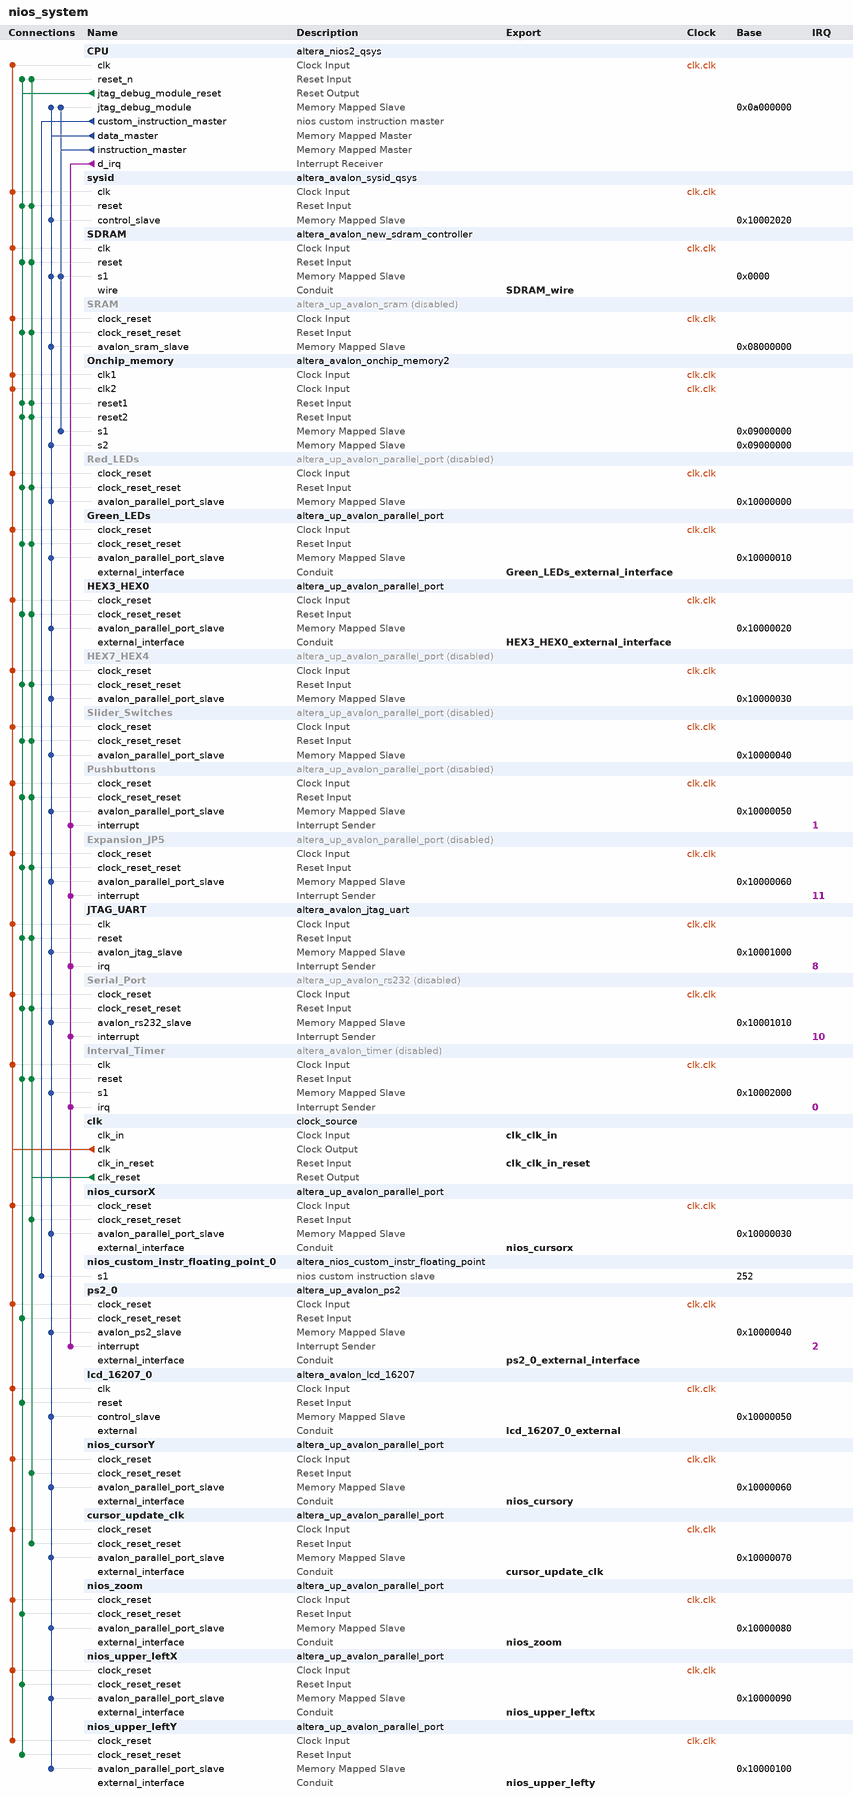
[diagram p0: system contents]
# Platform Designer (Qsys) system nios_system, Cyclone IV E EP4CE115F29C7
# Parameters at their usual value, and those the tool derives, are not listed.
package require -exact qsys 13.0
create_system nios_system
set_project_property DEVICE_FAMILY {Cyclone IV E}
set_project_property DEVICE EP4CE115F29C7

add_instance CPU altera_nios2_qsys 13.0
set_instance_parameter_value CPU muldiv_divider true
set_instance_parameter_value CPU manuallyAssignCpuID false
set_instance_parameter_value CPU resetSlave SDRAM.s1
set_instance_parameter_value CPU exceptionSlave SDRAM.s1
set_instance_parameter_value CPU breakSlave CPU.jtag_debug_module
set_instance_parameter_value CPU mmu_processIDNumBits 10
set_instance_parameter_value CPU impl Tiny
set_instance_parameter_value CPU icache_size 4096
set_instance_parameter_value CPU dcache_lineSize 4

add_instance sysid altera_avalon_sysid_qsys 13.0
set_instance_parameter_value sysid id 0

add_instance SDRAM altera_avalon_new_sdram_controller 13.0.1
set_instance_parameter_value SDRAM TAC 5.5
set_instance_parameter_value SDRAM TRCD 20.0
set_instance_parameter_value SDRAM TRP 20.0
set_instance_parameter_value SDRAM casLatency 3
set_instance_parameter_value SDRAM columnWidth 10
set_instance_parameter_value SDRAM dataWidth 32
set_instance_parameter_value SDRAM generateSimulationModel false
set_instance_parameter_value SDRAM model custom
set_instance_parameter_value SDRAM numberOfBanks 4
set_instance_parameter_value SDRAM numberOfChipSelects 1
set_instance_parameter_value SDRAM powerUpDelay 100.0
set_instance_parameter_value SDRAM refreshPeriod 15.625
set_instance_parameter_value SDRAM rowWidth 13

add_instance SRAM altera_up_avalon_sram 13.0
set_instance_property SRAM ENABLED false
set_instance_parameter_value SRAM board DE2-115
set_instance_parameter_value SRAM pixel_buffer true

add_instance Onchip_memory altera_avalon_onchip_memory2 13.0.1
set_instance_parameter_value Onchip_memory dataWidth 32
set_instance_parameter_value Onchip_memory dualPort true
set_instance_parameter_value Onchip_memory initMemContent true
set_instance_parameter_value Onchip_memory initializationFileName Onchip_memory
set_instance_parameter_value Onchip_memory memorySize 8192

add_instance Red_LEDs altera_up_avalon_parallel_port 13.0
set_instance_property Red_LEDs ENABLED false
set_instance_parameter_value Red_LEDs board DE2-115
set_instance_parameter_value Red_LEDs preset LEDs
set_instance_parameter_value Red_LEDs leds Red
set_instance_parameter_value Red_LEDs capture false
set_instance_parameter_value Red_LEDs edge Rising
set_instance_parameter_value Red_LEDs irq false

add_instance Green_LEDs altera_up_avalon_parallel_port 13.0
set_instance_parameter_value Green_LEDs board DE2-115
set_instance_parameter_value Green_LEDs preset LEDs
set_instance_parameter_value Green_LEDs capture false
set_instance_parameter_value Green_LEDs edge Rising
set_instance_parameter_value Green_LEDs irq false

add_instance HEX3_HEX0 altera_up_avalon_parallel_port 13.0
set_instance_parameter_value HEX3_HEX0 board DE2-115
set_instance_parameter_value HEX3_HEX0 preset {Seven Segment Displays}
set_instance_parameter_value HEX3_HEX0 capture false
set_instance_parameter_value HEX3_HEX0 edge Rising
set_instance_parameter_value HEX3_HEX0 irq false

add_instance HEX7_HEX4 altera_up_avalon_parallel_port 13.0
set_instance_property HEX7_HEX4 ENABLED false
set_instance_parameter_value HEX7_HEX4 board DE2-115
set_instance_parameter_value HEX7_HEX4 preset {Seven Segment Displays}
set_instance_parameter_value HEX7_HEX4 sevensegs {7 to 4}
set_instance_parameter_value HEX7_HEX4 capture false
set_instance_parameter_value HEX7_HEX4 edge Rising
set_instance_parameter_value HEX7_HEX4 irq false

add_instance Slider_Switches altera_up_avalon_parallel_port 13.0
set_instance_property Slider_Switches ENABLED false
set_instance_parameter_value Slider_Switches board DE2-115
set_instance_parameter_value Slider_Switches preset {Slider Switches}
set_instance_parameter_value Slider_Switches capture false
set_instance_parameter_value Slider_Switches edge Rising
set_instance_parameter_value Slider_Switches irq false

add_instance Pushbuttons altera_up_avalon_parallel_port 13.0
set_instance_property Pushbuttons ENABLED false
set_instance_parameter_value Pushbuttons board DE2-115
set_instance_parameter_value Pushbuttons preset Pushbuttons
set_instance_parameter_value Pushbuttons capture true
set_instance_parameter_value Pushbuttons edge Falling
set_instance_parameter_value Pushbuttons irq true

add_instance Expansion_JP5 altera_up_avalon_parallel_port 13.0
set_instance_property Expansion_JP5 ENABLED false
set_instance_parameter_value Expansion_JP5 board DE2-115
set_instance_parameter_value Expansion_JP5 preset {Expansion Header}
set_instance_parameter_value Expansion_JP5 capture true
set_instance_parameter_value Expansion_JP5 edge Falling
set_instance_parameter_value Expansion_JP5 irq true

add_instance JTAG_UART altera_avalon_jtag_uart 13.0.1
set_instance_parameter_value JTAG_UART simInteractiveOptions INTERACTIVE_ASCII_OUTPUT

add_instance Serial_Port altera_up_avalon_rs232 13.0
set_instance_property Serial_Port ENABLED false
set_instance_parameter_value Serial_Port baud 115200
set_instance_parameter_value Serial_Port parity Odd

add_instance Interval_Timer altera_avalon_timer 13.0.1
set_instance_property Interval_Timer ENABLED false
set_instance_parameter_value Interval_Timer period 125.0
set_instance_parameter_value Interval_Timer periodUnits MSEC

add_instance clk clock_source 13.0
set_instance_parameter_value clk clockFrequency 50000000

add_instance nios_cursorX altera_up_avalon_parallel_port 13.0
set_instance_parameter_value nios_cursorX board DE2-115
set_instance_parameter_value nios_cursorX custom_port true
set_instance_parameter_value nios_cursorX preset LEDs
set_instance_parameter_value nios_cursorX capture false
set_instance_parameter_value nios_cursorX edge Rising
set_instance_parameter_value nios_cursorX irq false

add_instance nios_custom_instr_floating_point_0 altera_nios_custom_instr_floating_point 13.0

add_instance ps2_0 altera_up_avalon_ps2 13.0

add_instance lcd_16207_0 altera_avalon_lcd_16207 13.0.1

add_instance nios_cursorY altera_up_avalon_parallel_port 13.0
set_instance_parameter_value nios_cursorY board DE2-115
set_instance_parameter_value nios_cursorY custom_port true
set_instance_parameter_value nios_cursorY preset LEDs
set_instance_parameter_value nios_cursorY capture false
set_instance_parameter_value nios_cursorY edge Rising
set_instance_parameter_value nios_cursorY irq false

add_instance cursor_update_clk altera_up_avalon_parallel_port 13.0
set_instance_parameter_value cursor_update_clk board DE2-115
set_instance_parameter_value cursor_update_clk custom_port true
set_instance_parameter_value cursor_update_clk preset LEDs
set_instance_parameter_value cursor_update_clk capture false
set_instance_parameter_value cursor_update_clk edge Rising
set_instance_parameter_value cursor_update_clk irq false

add_instance nios_zoom altera_up_avalon_parallel_port 13.0
set_instance_parameter_value nios_zoom board DE2-115
set_instance_parameter_value nios_zoom custom_port true
set_instance_parameter_value nios_zoom preset LEDs
set_instance_parameter_value nios_zoom capture false
set_instance_parameter_value nios_zoom edge Rising
set_instance_parameter_value nios_zoom irq false

add_instance nios_upper_leftX altera_up_avalon_parallel_port 13.0
set_instance_parameter_value nios_upper_leftX board DE2-115
set_instance_parameter_value nios_upper_leftX custom_port true
set_instance_parameter_value nios_upper_leftX preset LEDs
set_instance_parameter_value nios_upper_leftX capture false
set_instance_parameter_value nios_upper_leftX edge Rising
set_instance_parameter_value nios_upper_leftX irq false

add_instance nios_upper_leftY altera_up_avalon_parallel_port 13.0
set_instance_parameter_value nios_upper_leftY board DE2-115
set_instance_parameter_value nios_upper_leftY custom_port true
set_instance_parameter_value nios_upper_leftY preset LEDs
set_instance_parameter_value nios_upper_leftY capture false
set_instance_parameter_value nios_upper_leftY edge Rising
set_instance_parameter_value nios_upper_leftY irq false

# connections
add_connection clk.clk CPU.clk clock
add_connection clk.clk cursor_update_clk.clock_reset clock
add_connection clk.clk Expansion_JP5.clock_reset clock
add_connection clk.clk Green_LEDs.clock_reset clock
add_connection clk.clk HEX3_HEX0.clock_reset clock
add_connection clk.clk HEX7_HEX4.clock_reset clock
add_connection clk.clk Interval_Timer.clk clock
add_connection clk.clk JTAG_UART.clk clock
add_connection clk.clk lcd_16207_0.clk clock
add_connection clk.clk nios_cursorX.clock_reset clock
add_connection clk.clk nios_cursorY.clock_reset clock
add_connection clk.clk nios_upper_leftX.clock_reset clock
add_connection clk.clk nios_upper_leftY.clock_reset clock
add_connection clk.clk nios_zoom.clock_reset clock
add_connection clk.clk Onchip_memory.clk1 clock
add_connection clk.clk Onchip_memory.clk2 clock
add_connection clk.clk ps2_0.clock_reset clock
add_connection clk.clk Pushbuttons.clock_reset clock
add_connection clk.clk Red_LEDs.clock_reset clock
add_connection clk.clk SDRAM.clk clock
add_connection clk.clk Serial_Port.clock_reset clock
add_connection clk.clk Slider_Switches.clock_reset clock
add_connection clk.clk SRAM.clock_reset clock
add_connection clk.clk sysid.clk clock
add_connection clk.clk_reset CPU.reset_n reset
add_connection clk.clk_reset cursor_update_clk.clock_reset_reset reset
add_connection clk.clk_reset Expansion_JP5.clock_reset_reset reset
add_connection clk.clk_reset Green_LEDs.clock_reset_reset reset
add_connection clk.clk_reset HEX3_HEX0.clock_reset_reset reset
add_connection clk.clk_reset HEX7_HEX4.clock_reset_reset reset
add_connection clk.clk_reset Interval_Timer.reset reset
add_connection clk.clk_reset JTAG_UART.reset reset
add_connection clk.clk_reset nios_cursorX.clock_reset_reset reset
add_connection clk.clk_reset nios_cursorY.clock_reset_reset reset
add_connection clk.clk_reset Onchip_memory.reset1 reset
add_connection clk.clk_reset Onchip_memory.reset2 reset
add_connection clk.clk_reset Pushbuttons.clock_reset_reset reset
add_connection clk.clk_reset Red_LEDs.clock_reset_reset reset
add_connection clk.clk_reset SDRAM.reset reset
add_connection clk.clk_reset Serial_Port.clock_reset_reset reset
add_connection clk.clk_reset Slider_Switches.clock_reset_reset reset
add_connection clk.clk_reset SRAM.clock_reset_reset reset
add_connection clk.clk_reset sysid.reset reset
add_connection CPU.jtag_debug_module_reset CPU.reset_n reset
add_connection CPU.jtag_debug_module_reset Expansion_JP5.clock_reset_reset reset
add_connection CPU.jtag_debug_module_reset Green_LEDs.clock_reset_reset reset
add_connection CPU.jtag_debug_module_reset HEX3_HEX0.clock_reset_reset reset
add_connection CPU.jtag_debug_module_reset HEX7_HEX4.clock_reset_reset reset
add_connection CPU.jtag_debug_module_reset Interval_Timer.reset reset
add_connection CPU.jtag_debug_module_reset JTAG_UART.reset reset
add_connection CPU.jtag_debug_module_reset lcd_16207_0.reset reset
add_connection CPU.jtag_debug_module_reset nios_upper_leftX.clock_reset_reset reset
add_connection CPU.jtag_debug_module_reset nios_upper_leftY.clock_reset_reset reset
add_connection CPU.jtag_debug_module_reset nios_zoom.clock_reset_reset reset
add_connection CPU.jtag_debug_module_reset Onchip_memory.reset1 reset
add_connection CPU.jtag_debug_module_reset Onchip_memory.reset2 reset
add_connection CPU.jtag_debug_module_reset ps2_0.clock_reset_reset reset
add_connection CPU.jtag_debug_module_reset Pushbuttons.clock_reset_reset reset
add_connection CPU.jtag_debug_module_reset Red_LEDs.clock_reset_reset reset
add_connection CPU.jtag_debug_module_reset SDRAM.reset reset
add_connection CPU.jtag_debug_module_reset Serial_Port.clock_reset_reset reset
add_connection CPU.jtag_debug_module_reset Slider_Switches.clock_reset_reset reset
add_connection CPU.jtag_debug_module_reset SRAM.clock_reset_reset reset
add_connection CPU.jtag_debug_module_reset sysid.reset reset
add_connection CPU.data_master CPU.jtag_debug_module avalon
set_connection_parameter_value CPU.data_master/CPU.jtag_debug_module baseAddress 0x0a000000
add_connection CPU.data_master cursor_update_clk.avalon_parallel_port_slave avalon
set_connection_parameter_value CPU.data_master/cursor_update_clk.avalon_parallel_port_slave baseAddress 0x10000070
add_connection CPU.data_master Expansion_JP5.avalon_parallel_port_slave avalon
set_connection_parameter_value CPU.data_master/Expansion_JP5.avalon_parallel_port_slave baseAddress 0x10000060
add_connection CPU.data_master Green_LEDs.avalon_parallel_port_slave avalon
set_connection_parameter_value CPU.data_master/Green_LEDs.avalon_parallel_port_slave baseAddress 0x10000010
add_connection CPU.data_master HEX3_HEX0.avalon_parallel_port_slave avalon
set_connection_parameter_value CPU.data_master/HEX3_HEX0.avalon_parallel_port_slave baseAddress 0x10000020
add_connection CPU.data_master HEX7_HEX4.avalon_parallel_port_slave avalon
set_connection_parameter_value CPU.data_master/HEX7_HEX4.avalon_parallel_port_slave baseAddress 0x10000030
add_connection CPU.data_master Interval_Timer.s1 avalon
set_connection_parameter_value CPU.data_master/Interval_Timer.s1 baseAddress 0x10002000
add_connection CPU.data_master JTAG_UART.avalon_jtag_slave avalon
set_connection_parameter_value CPU.data_master/JTAG_UART.avalon_jtag_slave baseAddress 0x10001000
add_connection CPU.data_master lcd_16207_0.control_slave avalon
set_connection_parameter_value CPU.data_master/lcd_16207_0.control_slave baseAddress 0x10000050
add_connection CPU.data_master nios_cursorX.avalon_parallel_port_slave avalon
set_connection_parameter_value CPU.data_master/nios_cursorX.avalon_parallel_port_slave baseAddress 0x10000030
add_connection CPU.data_master nios_cursorY.avalon_parallel_port_slave avalon
set_connection_parameter_value CPU.data_master/nios_cursorY.avalon_parallel_port_slave baseAddress 0x10000060
add_connection CPU.data_master nios_upper_leftX.avalon_parallel_port_slave avalon
set_connection_parameter_value CPU.data_master/nios_upper_leftX.avalon_parallel_port_slave baseAddress 0x10000090
add_connection CPU.data_master nios_upper_leftY.avalon_parallel_port_slave avalon
set_connection_parameter_value CPU.data_master/nios_upper_leftY.avalon_parallel_port_slave baseAddress 0x10000100
add_connection CPU.data_master nios_zoom.avalon_parallel_port_slave avalon
set_connection_parameter_value CPU.data_master/nios_zoom.avalon_parallel_port_slave baseAddress 0x10000080
add_connection CPU.data_master Onchip_memory.s2 avalon
set_connection_parameter_value CPU.data_master/Onchip_memory.s2 baseAddress 0x09000000
add_connection CPU.data_master ps2_0.avalon_ps2_slave avalon
set_connection_parameter_value CPU.data_master/ps2_0.avalon_ps2_slave baseAddress 0x10000040
add_connection CPU.data_master Pushbuttons.avalon_parallel_port_slave avalon
set_connection_parameter_value CPU.data_master/Pushbuttons.avalon_parallel_port_slave baseAddress 0x10000050
add_connection CPU.data_master Red_LEDs.avalon_parallel_port_slave avalon
set_connection_parameter_value CPU.data_master/Red_LEDs.avalon_parallel_port_slave baseAddress 0x10000000
add_connection CPU.data_master SDRAM.s1 avalon
set_connection_parameter_value CPU.data_master/SDRAM.s1 baseAddress 0x0000
add_connection CPU.data_master Serial_Port.avalon_rs232_slave avalon
set_connection_parameter_value CPU.data_master/Serial_Port.avalon_rs232_slave baseAddress 0x10001010
add_connection CPU.data_master Slider_Switches.avalon_parallel_port_slave avalon
set_connection_parameter_value CPU.data_master/Slider_Switches.avalon_parallel_port_slave baseAddress 0x10000040
add_connection CPU.data_master SRAM.avalon_sram_slave avalon
set_connection_parameter_value CPU.data_master/SRAM.avalon_sram_slave baseAddress 0x08000000
add_connection CPU.data_master sysid.control_slave avalon
set_connection_parameter_value CPU.data_master/sysid.control_slave baseAddress 0x10002020
add_connection CPU.instruction_master CPU.jtag_debug_module avalon
set_connection_parameter_value CPU.instruction_master/CPU.jtag_debug_module baseAddress 0x0a000000
add_connection CPU.instruction_master Onchip_memory.s1 avalon
set_connection_parameter_value CPU.instruction_master/Onchip_memory.s1 baseAddress 0x09000000
add_connection CPU.instruction_master SDRAM.s1 avalon
set_connection_parameter_value CPU.instruction_master/SDRAM.s1 baseAddress 0x0000
add_connection CPU.d_irq Expansion_JP5.interrupt interrupt
set_connection_parameter_value CPU.d_irq/Expansion_JP5.interrupt irqNumber 11
add_connection CPU.d_irq Interval_Timer.irq interrupt
set_connection_parameter_value CPU.d_irq/Interval_Timer.irq irqNumber 0
add_connection CPU.d_irq JTAG_UART.irq interrupt
set_connection_parameter_value CPU.d_irq/JTAG_UART.irq irqNumber 8
add_connection CPU.d_irq ps2_0.interrupt interrupt
set_connection_parameter_value CPU.d_irq/ps2_0.interrupt irqNumber 2
add_connection CPU.d_irq Pushbuttons.interrupt interrupt
set_connection_parameter_value CPU.d_irq/Pushbuttons.interrupt irqNumber 1
add_connection CPU.d_irq Serial_Port.interrupt interrupt
set_connection_parameter_value CPU.d_irq/Serial_Port.interrupt irqNumber 10
add_connection CPU.custom_instruction_master nios_custom_instr_floating_point_0.s1 nios_custom_instruction
set_connection_parameter_value CPU.custom_instruction_master/nios_custom_instr_floating_point_0.s1 CIName nios_custom_instr_floating_point_0
set_connection_parameter_value CPU.custom_instruction_master/nios_custom_instr_floating_point_0.s1 baseAddress 252

# exported interfaces
add_interface SDRAM_wire conduit end
set_interface_property SDRAM_wire EXPORT_OF SDRAM.wire
add_interface clk_clk_in_reset reset sink
set_interface_property clk_clk_in_reset EXPORT_OF clk.clk_in_reset
add_interface Green_LEDs_external_interface conduit end
set_interface_property Green_LEDs_external_interface EXPORT_OF Green_LEDs.external_interface
add_interface clk_clk_in clock sink
set_interface_property clk_clk_in EXPORT_OF clk.clk_in
add_interface HEX3_HEX0_external_interface conduit end
set_interface_property HEX3_HEX0_external_interface EXPORT_OF HEX3_HEX0.external_interface
add_interface nios_cursorx conduit end
set_interface_property nios_cursorx EXPORT_OF nios_cursorX.external_interface
add_interface ps2_0_external_interface conduit end
set_interface_property ps2_0_external_interface EXPORT_OF ps2_0.external_interface
add_interface lcd_16207_0_external conduit end
set_interface_property lcd_16207_0_external EXPORT_OF lcd_16207_0.external
add_interface nios_cursory conduit end
set_interface_property nios_cursory EXPORT_OF nios_cursorY.external_interface
add_interface cursor_update_clk conduit end
set_interface_property cursor_update_clk EXPORT_OF cursor_update_clk.external_interface
add_interface nios_zoom conduit end
set_interface_property nios_zoom EXPORT_OF nios_zoom.external_interface
add_interface nios_upper_leftx conduit end
set_interface_property nios_upper_leftx EXPORT_OF nios_upper_leftX.external_interface
add_interface nios_upper_lefty conduit end
set_interface_property nios_upper_lefty EXPORT_OF nios_upper_leftY.external_interface

set_interconnect_requirement {$system} qsys_mm.clockCrossingAdapter HANDSHAKE
set_interconnect_requirement {$system} qsys_mm.maxAdditionalLatency 0

save_system nios_system.qsys
